# EAGLE schematic 00A-024 FRDM Protoboard (EAGLE 6.3)

## Sheet 1 of 2
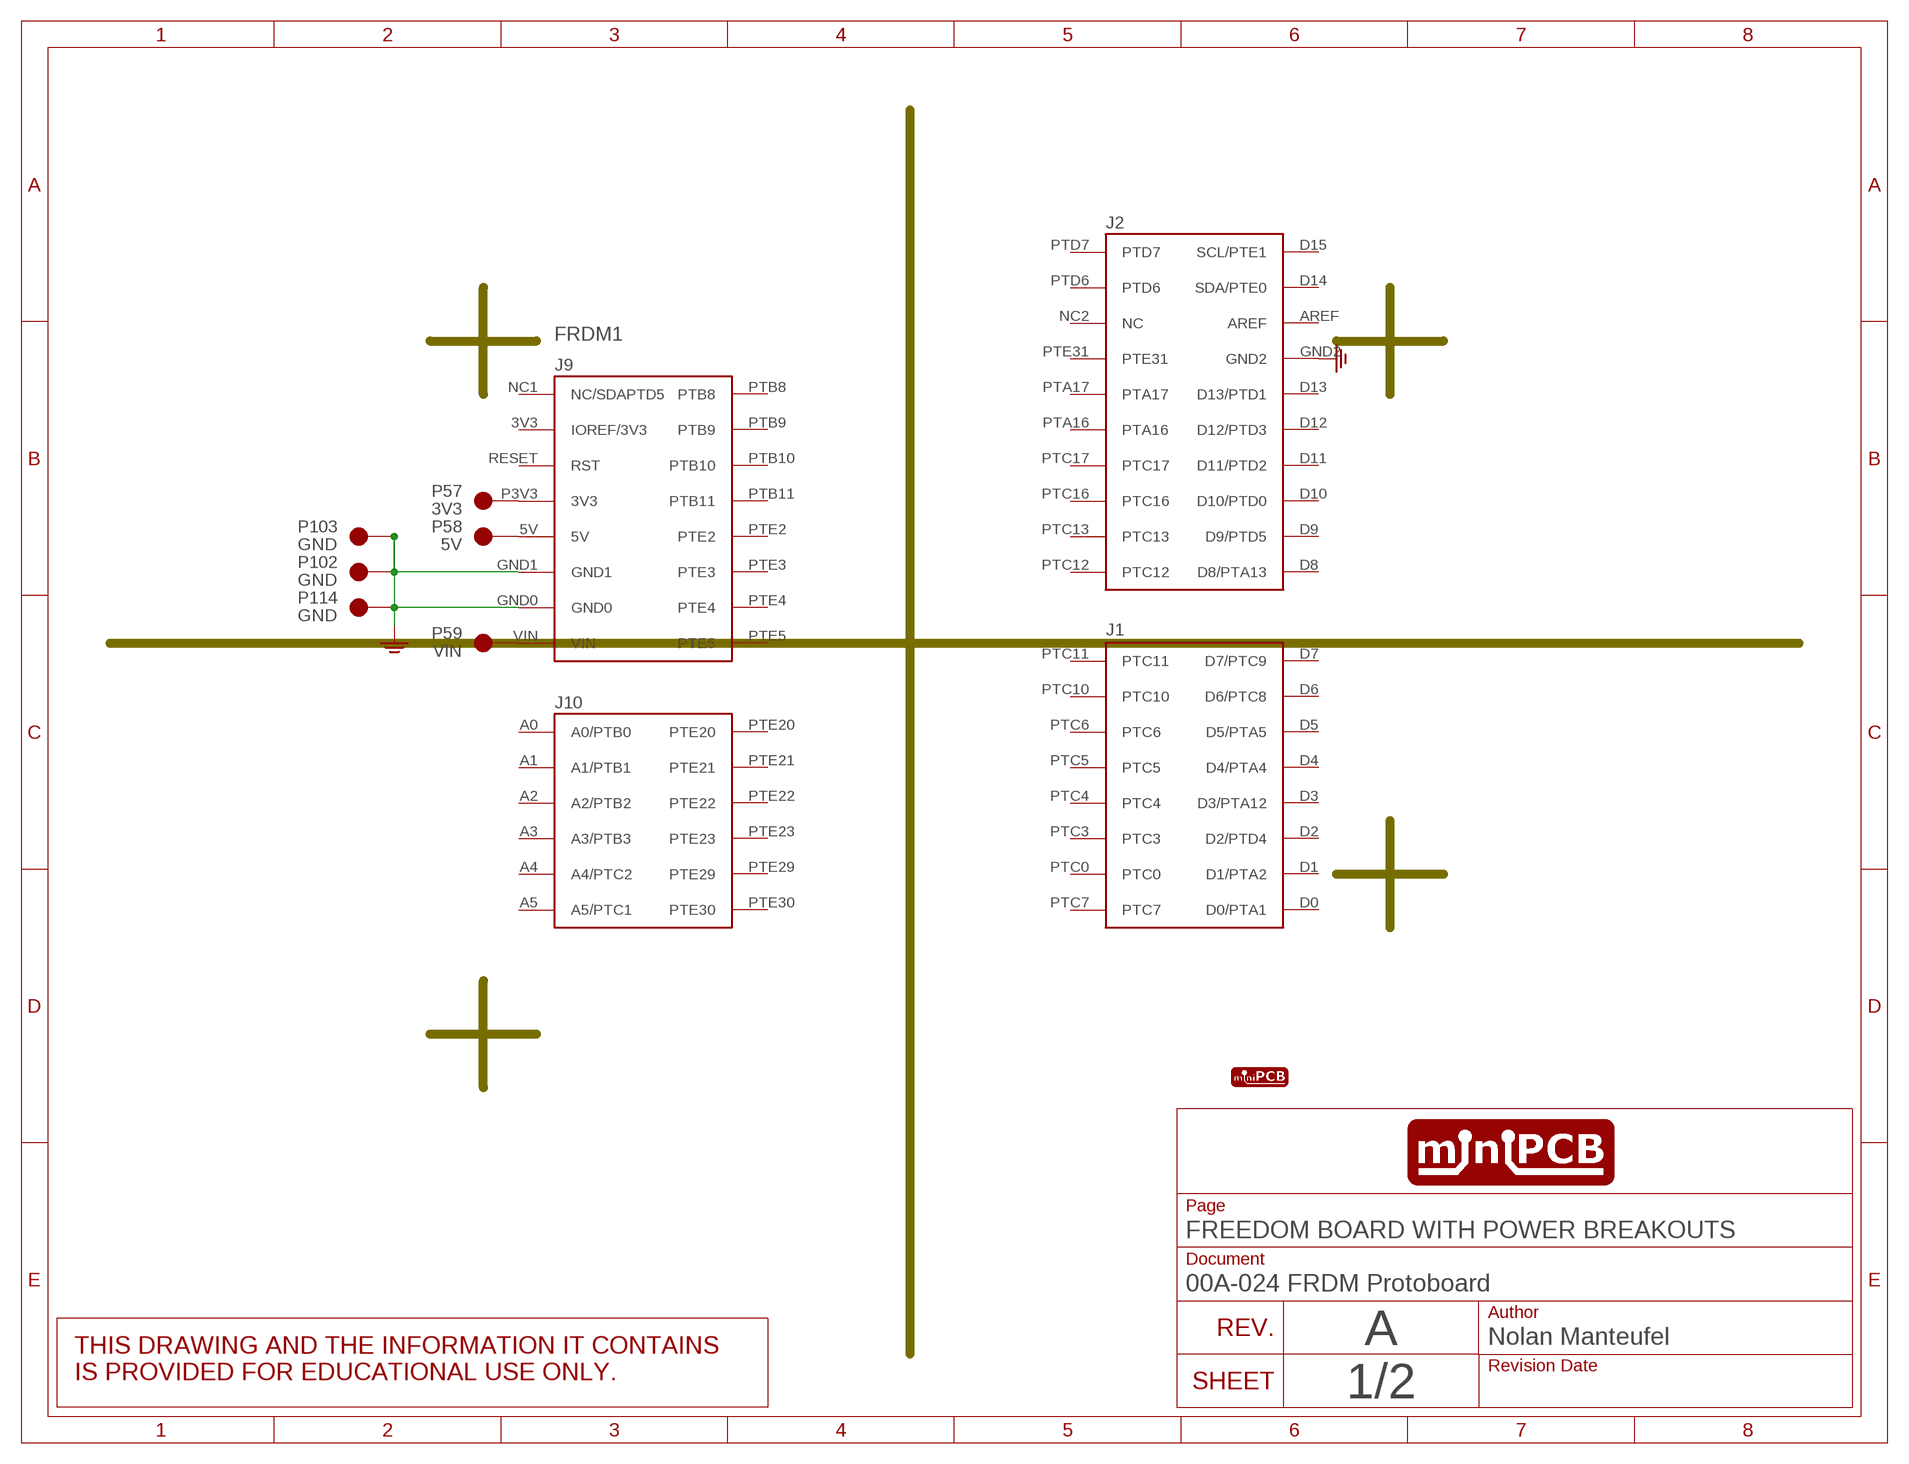
[diagram p0: schematic, sheet 1]
SHEET1 (SCHEMATIC-MINIPCB): REVISION: A

### Parts
FRDM1  FRDM-KL25ZNORMAL  [FRDM_KL25Z_NORMAL]
P57  3V3  PINS_13P_VALUE  [PINS_1-3P_VALUE]
P58  5V  PINS_13P_VALUE  [PINS_1-3P_VALUE]
P59  VIN  PINS_13P_VALUE  [PINS_1-3P_VALUE]
P102  GND  PINS_13P_VALUE  [PINS_1-3P_VALUE]
P103  GND  PINS_13P_VALUE  [PINS_1-3P_VALUE]
P114  GND  PINS_13P_VALUE  [PINS_1-3P_VALUE]
U$1  MINIPCB_LOGO  [MINIPCB-LOGO]

### Nets
GND: FRDM1.GND0 FRDM1.GND1 FRDM1.GND2 P102.1 P102.2 P102.3 P103.1 P103.2 P103.3 P114.1 P114.2 P114.3
N$57: FRDM1.P3V3(3V3) P57.1 P57.2 P57.3
N$58: FRDM1.5V P58.1 P58.2 P58.3
N$59: FRDM1.VIN P59.1 P59.2 P59.3
Unconnected: FRDM1.3V3(IOREF/3V3) FRDM1.A0(A0/PTB0) FRDM1.A1(A1/PTB1) FRDM1.A2(A2/PTB2) FRDM1.A3(A3/PTB3) FRDM1.A4(A4/PTC2) FRDM1.A5(A5/PTC1) FRDM1.AREF FRDM1.D0(D0/PTA1) FRDM1.D1(D1/PTA2) FRDM1.D2(D2/PTD4) FRDM1.D3(D3/PTA12) FRDM1.D4(D4/PTA4) FRDM1.D5(D5/PTA5) FRDM1.D6(D6/PTC8) FRDM1.D7(D7/PTC9) FRDM1.D8(D8/PTA13) FRDM1.D9(D9/PTD5) FRDM1.D10(D10/PTD0) FRDM1.D11(D11/PTD2) FRDM1.D12(D12/PTD3) FRDM1.D13(D13/PTD1) FRDM1.D14(SDA/PTE0) FRDM1.D15(SCL/PTE1) FRDM1.NC1(NC/SDAPTD5) FRDM1.NC2(NC) FRDM1.PTA16 FRDM1.PTA17 FRDM1.PTB8 FRDM1.PTB9 FRDM1.PTB10 FRDM1.PTB11 FRDM1.PTC0 FRDM1.PTC3 FRDM1.PTC4 FRDM1.PTC5 FRDM1.PTC6 FRDM1.PTC7 FRDM1.PTC10 FRDM1.PTC11 FRDM1.PTC12 FRDM1.PTC13 FRDM1.PTC16 FRDM1.PTC17 FRDM1.PTD6 FRDM1.PTD7 FRDM1.PTE2 FRDM1.PTE3 FRDM1.PTE4 FRDM1.PTE5 FRDM1.PTE20 FRDM1.PTE21 FRDM1.PTE22 FRDM1.PTE23 FRDM1.PTE29 FRDM1.PTE30 FRDM1.PTE31 FRDM1.RESET(RST)

## Sheet 2 of 2
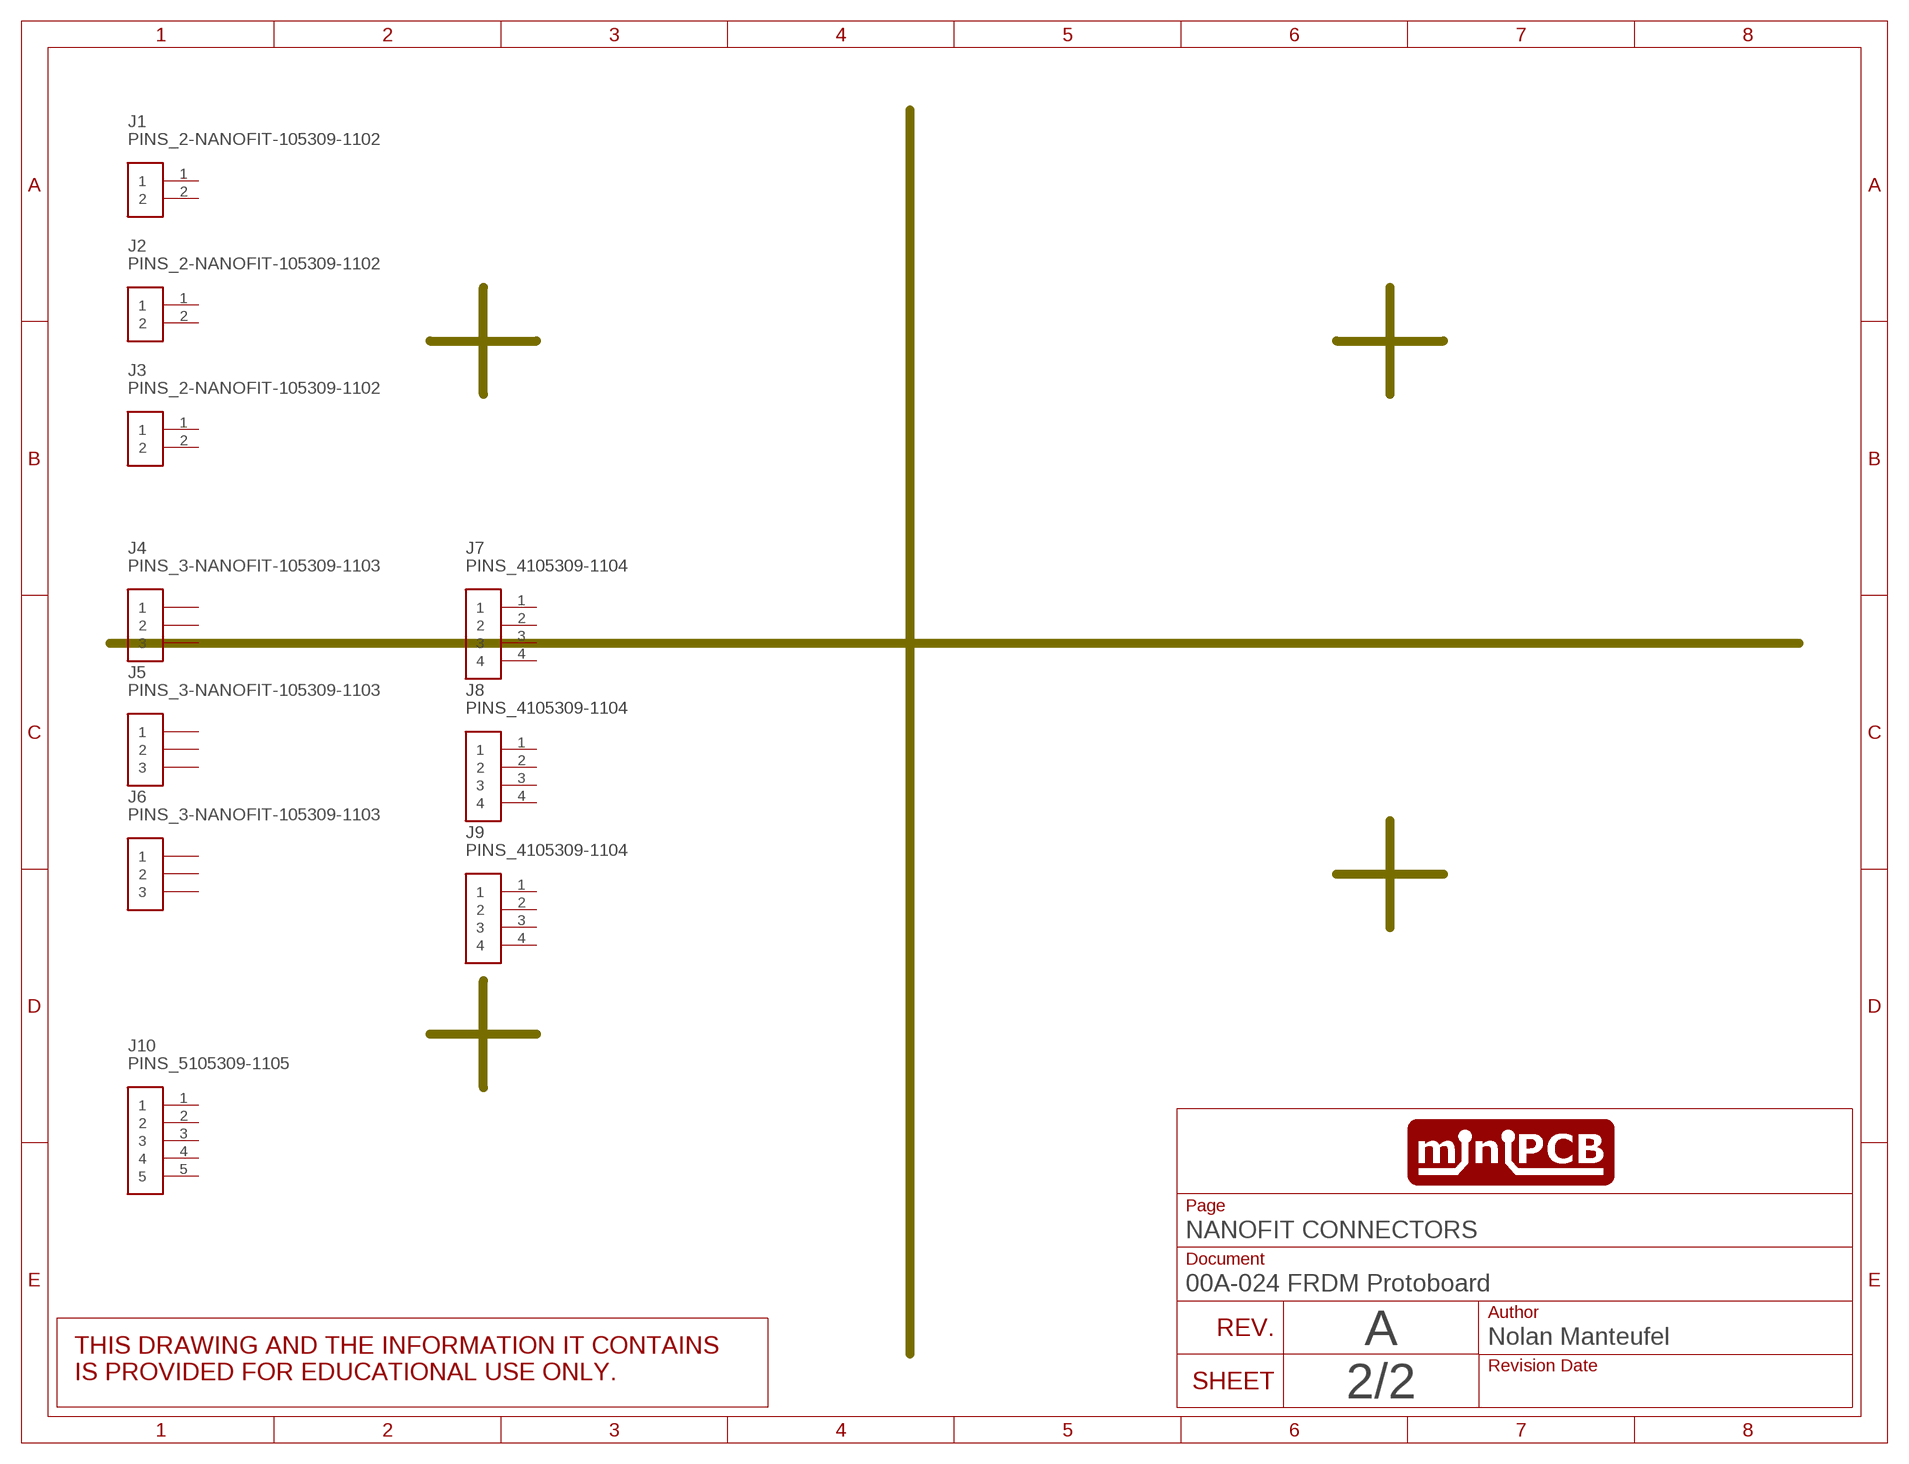
[diagram p1: schematic, sheet 2]
SHEET2 (SCHEMATIC-MINIPCB): REVISION: A

### Parts
J1  PINS_2-NANOFIT-105309-1102  [PINS_2-NANOFIT]
J2  PINS_2-NANOFIT-105309-1102  [PINS_2-NANOFIT]
J3  PINS_2-NANOFIT-105309-1102  [PINS_2-NANOFIT]
J4  PINS_3-NANOFIT-105309-1103  [PINS_3-NANOFIT]
J5  PINS_3-NANOFIT-105309-1103  [PINS_3-NANOFIT]
J6  PINS_3-NANOFIT-105309-1103  [PINS_3-NANOFIT]
J7  PINS_4105309-1104  [PINS_4-NANOFIT]
J8  PINS_4105309-1104  [PINS_4-NANOFIT]
J9  PINS_4105309-1104  [PINS_4-NANOFIT]
J10  PINS_5105309-1105  [PINS_5-NANOFIT]
Unconnected: J1.1 J1.2 J2.1 J2.2 J3.1 J3.2 J4.1 J4.2 J4.3 J5.1 J5.2 J5.3 J6.1 J6.2 J6.3 J7.1 J7.2 J7.3 J7.4 J8.1 J8.2 J8.3 J8.4 J9.1 J9.2 J9.3 J9.4 J10.1 J10.2 J10.3 J10.4 J10.5

## Library data of the parts
FRDM1 = nolan:FRDM-KL25Z: For creating FRDM-KL25Z shields Check prices <https://pricing.snapeda.com/parts/FRDM-KL25Z/NXP%20USA/view-part?ref=eda>; AVAILABILITY: In Stock; DESCRIPTION: KL1x, KL2x, mbed-Enabled Development Freedom Kinetis ARM® Cortex®-M0+ MCU 32-Bit Embedded Evaluation Board; MF: NXP USA; MP: FRDM-KL25Z; PACKAGE: 0805 Freescale Semiconductor; PRICE: None; PURCHASE-URL: https://pricing.snapeda.com/search/part/FRDM-KL25Z/?ref=eda
J1-J3 = nolan:PINS_2
J4-J6 = nolan:PINS_3
J7-J9 = nolan:PINS_4
J10 = nolan:PINS_5
P57-P59 P102 P103 P114 = nolan:PINS_1
U$1 = nolan:MINIPCB_LOGO